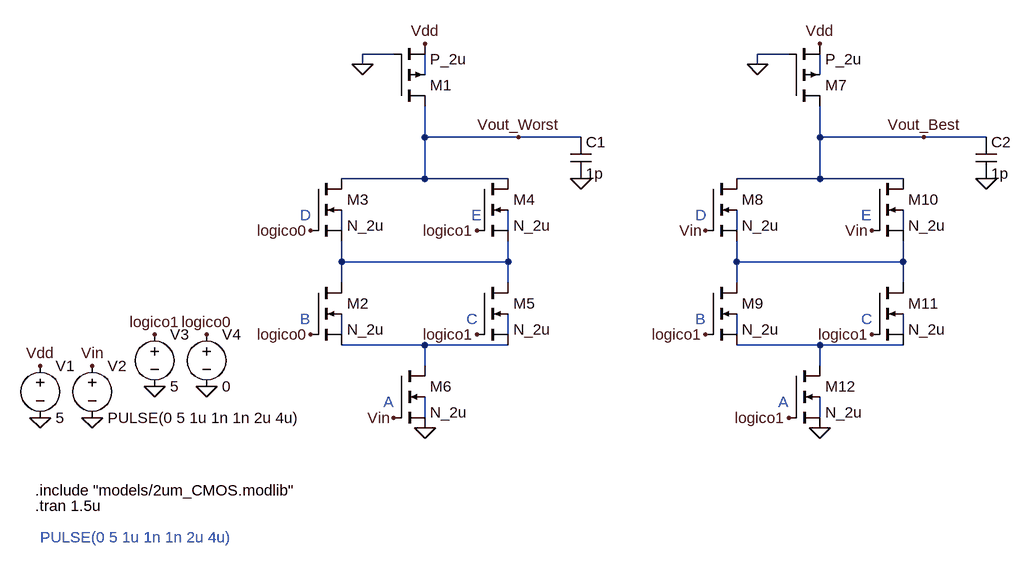
[diagram p0: schematic 3b.asc]
3b.asc, the LTspice schematic file:
Version 4
SHEET 1 1224 680
WIRE 128 -256 80 -256
WIRE 736 -256 688 -256
WIRE 80 -240 80 -256
WIRE 688 -240 688 -256
WIRE 176 -224 176 -256
WIRE 784 -224 784 -256
WIRE 176 -128 176 -176
WIRE 320 -128 176 -128
WIRE 416 -128 320 -128
WIRE 784 -128 784 -176
WIRE 944 -128 784 -128
WIRE 1040 -128 944 -128
WIRE 176 -64 176 -128
WIRE 176 -64 48 -64
WIRE 304 -64 176 -64
WIRE 784 -64 784 -128
WIRE 784 -64 656 -64
WIRE 912 -64 784 -64
WIRE 48 16 48 -16
WIRE 304 16 304 -16
WIRE 656 16 656 -16
WIRE 912 16 912 -16
WIRE 48 64 48 32
WIRE 304 64 304 32
WIRE 304 64 48 64
WIRE 656 64 656 32
WIRE 912 64 912 32
WIRE 912 64 656 64
WIRE 48 96 48 64
WIRE 304 96 304 64
WIRE 656 96 656 64
WIRE 912 96 912 64
WIRE 48 176 48 144
WIRE 304 176 304 144
WIRE 656 176 656 144
WIRE 912 176 912 144
WIRE 176 192 48 192
WIRE 304 192 176 192
WIRE 784 192 656 192
WIRE 912 192 784 192
WIRE 176 224 176 192
WIRE 784 224 784 192
WIRE 176 304 176 272
WIRE 784 304 784 272
FLAG 80 -240 0
FLAG 176 320 0
FLAG 176 -272 Vdd
FLAG 320 -128 Vout_Worst
FLAG -336 224 Vin
FLAG -416 224 Vdd
FLAG -416 304 0
FLAG -336 304 0
FLAG 128 304 Vin
FLAG 688 -240 0
FLAG 784 320 0
FLAG 784 -272 Vdd
FLAG 944 -128 Vout_Best
FLAG 608 16 Vin
FLAG 864 16 Vin
FLAG -240 256 0
FLAG -160 256 0
FLAG -240 176 logico1
FLAG -160 176 logico0
FLAG 0 176 logico0
FLAG 0 16 logico0
FLAG 256 16 logico1
FLAG 256 176 logico1
FLAG 608 176 logico1
FLAG 864 176 logico1
FLAG 736 304 logico1
FLAG 416 -64 0
FLAG 1040 -64 0
SYMBOL pmos4 128 -176 M180
SYMATTR InstName M1
SYMATTR Value P_2u
SYMATTR Value2 l=2u w=6u
SYMBOL nmos4 0 -64 R0
SYMATTR InstName M3
SYMATTR Value N_2u
SYMATTR Value2 l=2u w=12u
SYMBOL nmos4 0 96 R0
SYMATTR InstName M2
SYMATTR Value N_2u
SYMATTR Value2 l=2u w=12u
SYMBOL nmos4 256 -64 R0
SYMATTR InstName M4
SYMATTR Value N_2u
SYMATTR Value2 l=2u w=12u
SYMBOL nmos4 256 96 R0
SYMATTR InstName M5
SYMATTR Value N_2u
SYMATTR Value2 l=2u w=12u
SYMBOL nmos4 128 224 R0
SYMATTR InstName M6
SYMATTR Value N_2u
SYMATTR Value2 l=2u w=12u
SYMBOL voltage -416 208 R0
WINDOW 123 0 0 Left 0
WINDOW 39 0 0 Left 0
SYMATTR InstName V1
SYMATTR Value 5
SYMBOL voltage -336 208 R0
WINDOW 123 0 0 Left 0
WINDOW 39 0 0 Left 0
SYMATTR InstName V2
SYMATTR Value PULSE(0 5 1u 1n 1n 2u 4u)
SYMBOL pmos4 736 -176 M180
SYMATTR InstName M7
SYMATTR Value P_2u
SYMATTR Value2 l=2u w=6u
SYMBOL nmos4 608 -64 R0
SYMATTR InstName M8
SYMATTR Value N_2u
SYMATTR Value2 l=2u w=12u
SYMBOL nmos4 608 96 R0
SYMATTR InstName M9
SYMATTR Value N_2u
SYMATTR Value2 l=2u w=12u
SYMBOL nmos4 864 -64 R0
SYMATTR InstName M10
SYMATTR Value N_2u
SYMATTR Value2 l=2u w=12u
SYMBOL nmos4 864 96 R0
SYMATTR InstName M11
SYMATTR Value N_2u
SYMATTR Value2 l=2u w=12u
SYMBOL nmos4 736 224 R0
SYMATTR InstName M12
SYMATTR Value N_2u
SYMATTR Value2 l=2u w=12u
SYMBOL voltage -240 160 R0
WINDOW 123 0 0 Left 0
WINDOW 39 0 0 Left 0
SYMATTR InstName V3
SYMATTR Value 5
SYMBOL voltage -160 160 R0
WINDOW 123 0 0 Left 0
WINDOW 39 0 0 Left 0
SYMATTR InstName V4
SYMATTR Value 0
SYMBOL cap 400 -128 R0
SYMATTR InstName C1
SYMATTR Value 1p
SYMBOL cap 1024 -128 R0
SYMATTR InstName C2
SYMATTR Value 1p
TEXT -424 416 Left 2 !.include "models/2um_CMOS.modlib"
TEXT -416 488 Left 2 ;PULSE(0 5 1u 1n 1n 2u 4u)
TEXT -424 440 Left 2 !.tran 1.5u
TEXT 112 280 Left 2 ;A
TEXT 720 280 Left 2 ;A
TEXT 248 -8 Left 2 ;E
TEXT 240 152 Left 2 ;C
TEXT -16 152 Left 2 ;B
TEXT -16 -8 Left 2 ;D
TEXT 592 -8 Left 2 ;D
TEXT 592 152 Left 2 ;B
TEXT 848 152 Left 2 ;C
TEXT 848 -8 Left 2 ;E

The netlist it stands for:
* 3b.asc
M1 Vout_Worst 0 Vdd N001 P_2u l=2u w=6u
M3 Vout_Worst logico0 N007 N003 N_2u l=2u w=12u
M2 N007 logico0 N013 N009 N_2u l=2u w=12u
M4 Vout_Worst logico1 N007 N004 N_2u l=2u w=12u
M5 N007 logico1 N013 N010 N_2u l=2u w=12u
M6 N013 Vin 0 N015 N_2u l=2u w=12u
V1 Vdd 0 5
V2 Vin 0 PULSE(0 5 1u 1n 1n 2u 4u)
M7 Vout_Best 0 Vdd N002 P_2u l=2u w=6u
M8 Vout_Best Vin N008 N005 N_2u l=2u w=12u
M9 N008 logico1 N014 N011 N_2u l=2u w=12u
M10 Vout_Best Vin N008 N006 N_2u l=2u w=12u
M11 N008 logico1 N014 N012 N_2u l=2u w=12u
M12 N014 logico1 0 N016 N_2u l=2u w=12u
V3 logico1 0 5
V4 logico0 0 0
C1 Vout_Worst 0 1p
C2 Vout_Best 0 1p
.model NMOS NMOS
.model PMOS PMOS
.lib standard.mos
.include "models/2um_CMOS.modlib"
* PULSE(0 5 1u 1n 1n 2u 4u)
.tran 1.5u
* A
* A
* E
* C
* B
* D
* D
* B
* C
* E
.backanno
.end